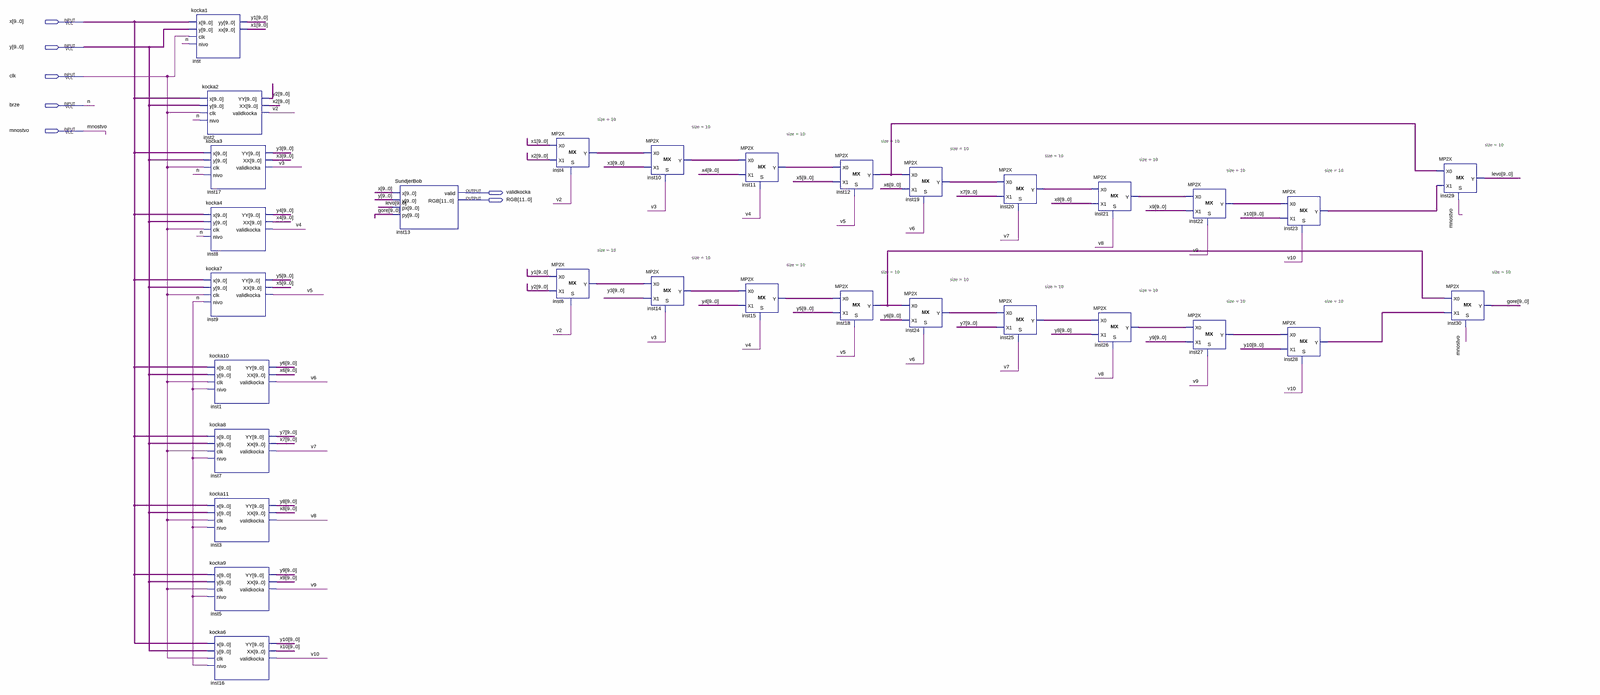
[diagram p0: schematic sheet, whole]
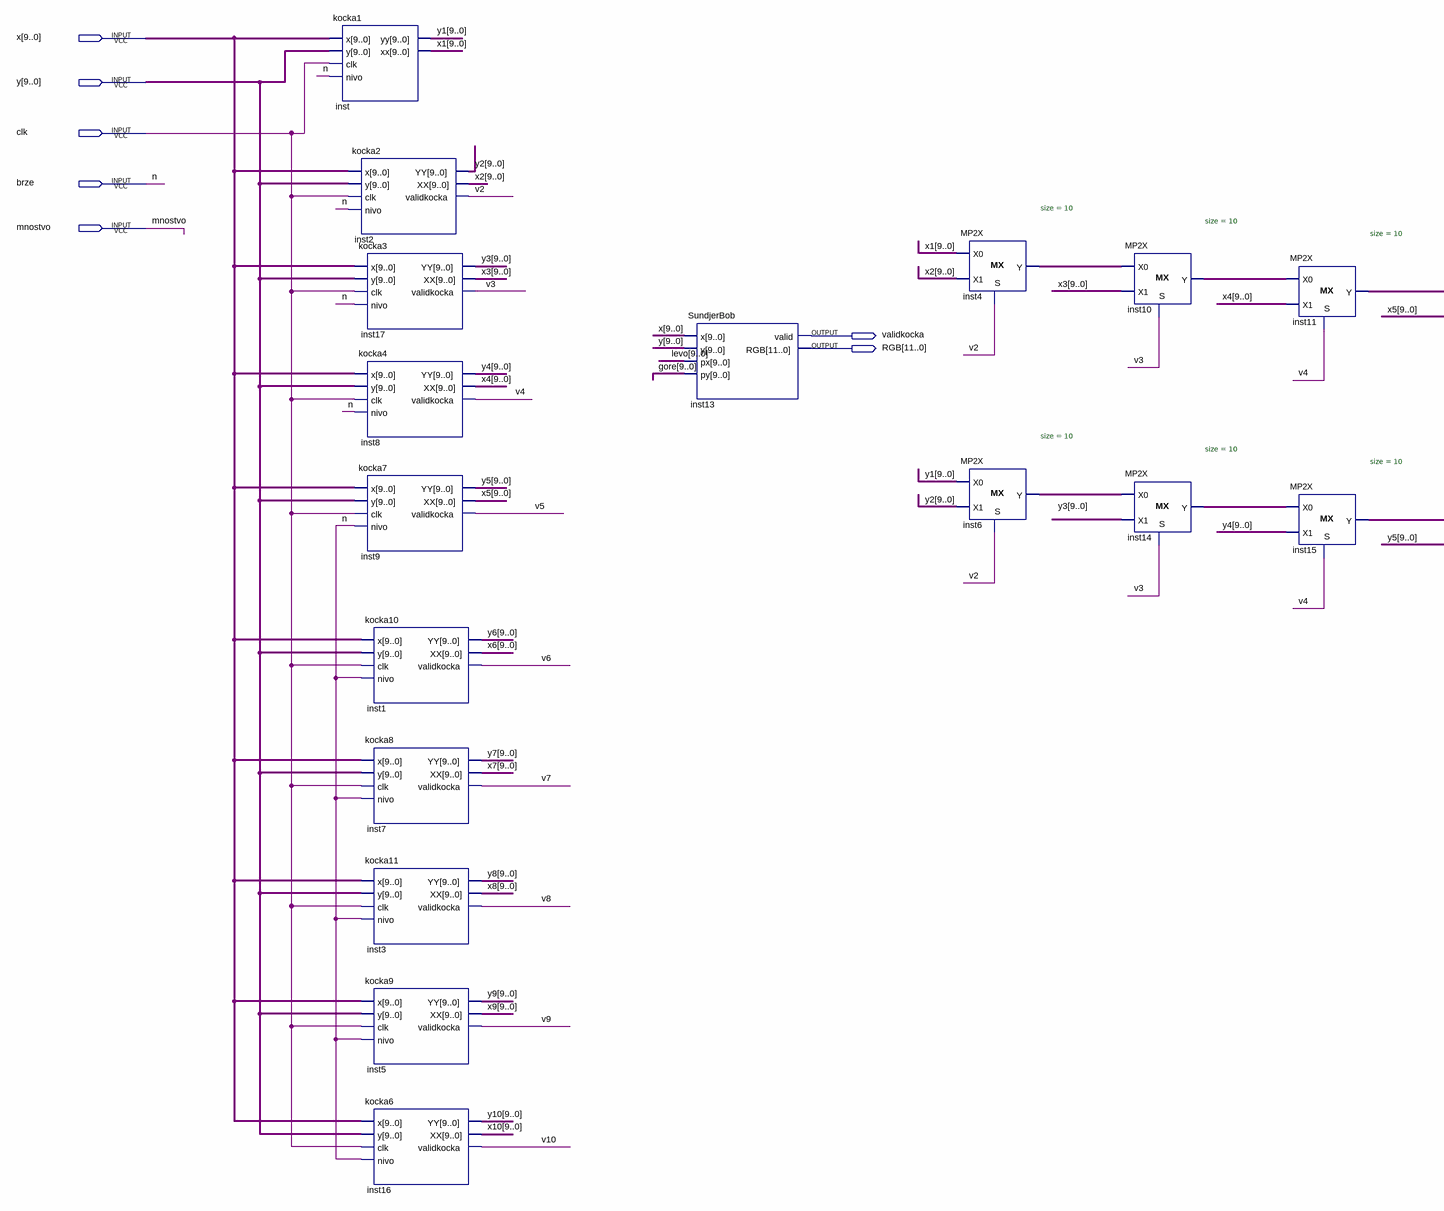
[diagram p1: schematic sheet, left part]
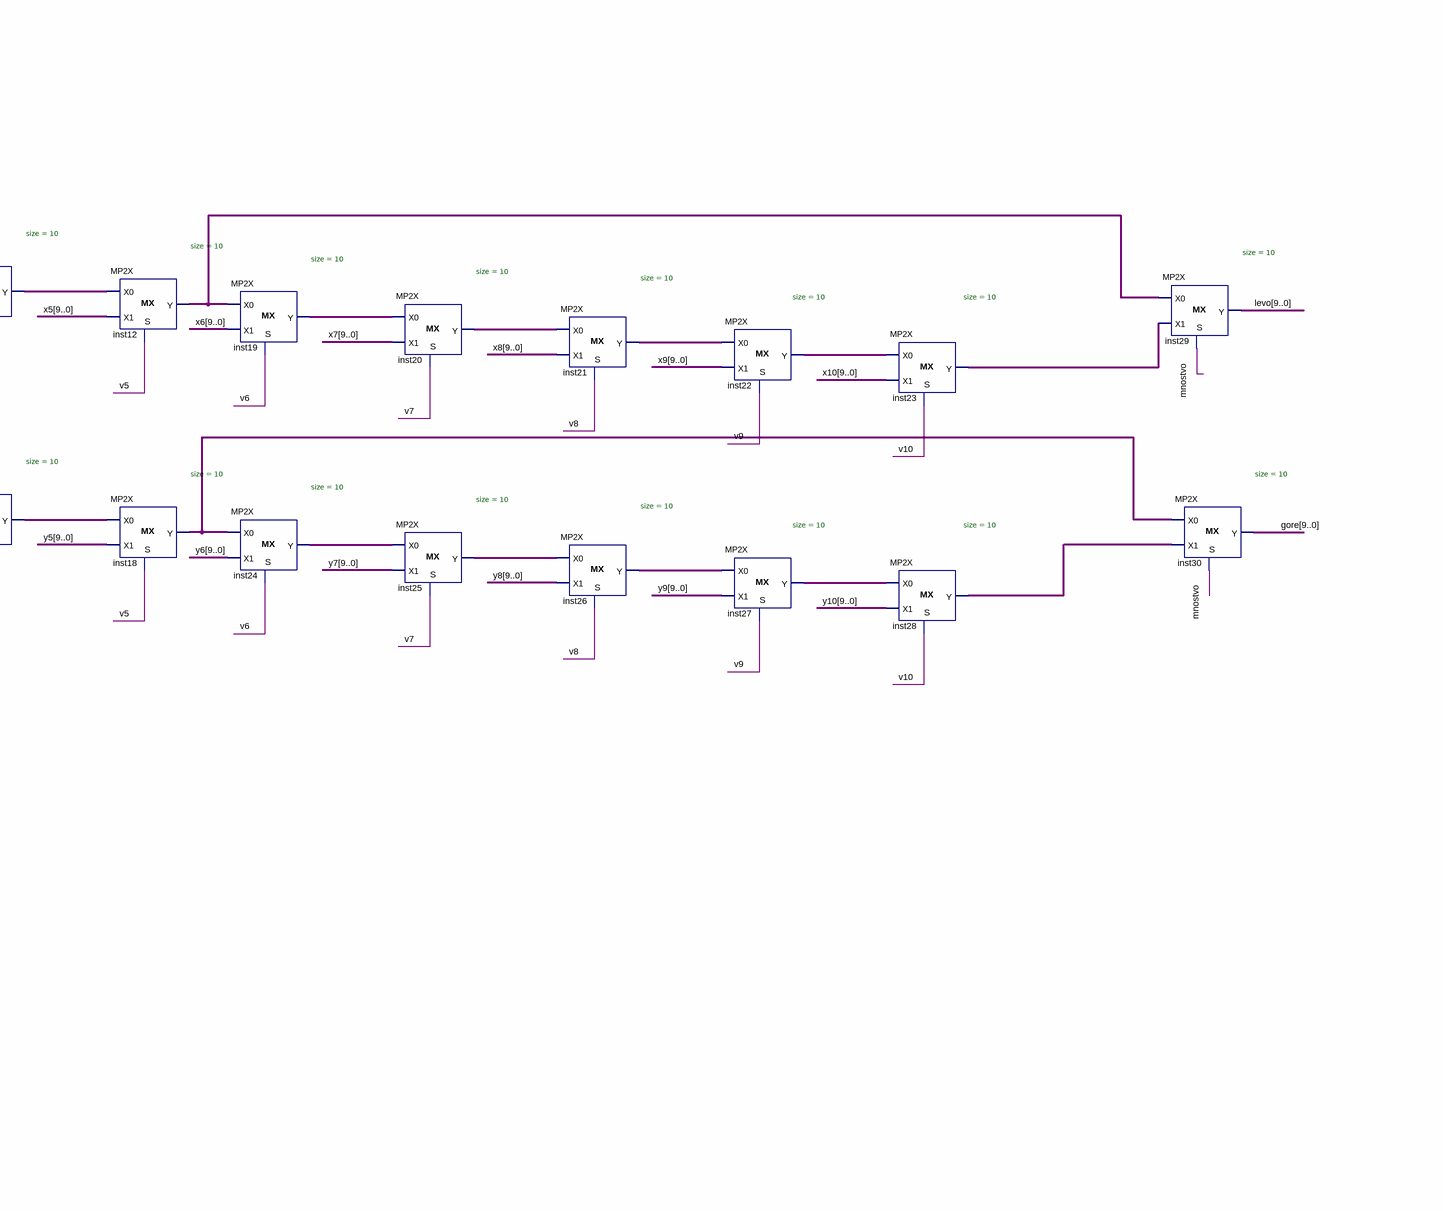
[diagram p2: schematic sheet, right part]
// Quartus schematic prepreke.bdf as structural Verilog: 31 symbols, 7 pins
module prepreke (
  input  [9:0] x,
  input  [9:0] y,
  input  clk,
  input  brze,
  input  mnostvo,
  output validkocka,
  output [11:0] RGB
);

  wire v2, v3, v4, v5, v6, v7, v8, v9, v10;
  wire [9:0] gore, inst4_y, inst6_y, inst10_y, inst11_y, inst12_y, inst14_y, inst15_y, inst18_y, inst19_y,
       inst20_y, inst21_y, inst22_y, inst23_y, inst24_y, inst25_y, inst26_y, inst27_y, inst28_y, levo, x1,
       x2, x3, x4, x5, x6, x7, x8, x9, x10, y1, y2, y3, y4, y5, y6, y7, y8, y9, y10;

  kocka1 inst (.x(x), .y(y), .clk(clk), .nivo(brze), .yy(y1), .xx(x1));
  kocka2 inst2 (.x(x), .y(y), .clk(clk), .nivo(brze), .YY(y2), .XX(x2), .validkocka(v2));
  kocka3 inst17 (.x(x), .y(y), .clk(clk), .nivo(brze), .YY(y3), .XX(x3), .validkocka(v3));
  kocka4 inst8 (.x(x), .y(y), .clk(clk), .nivo(brze), .YY(y4), .XX(x4), .validkocka(v4));
  kocka7 inst9 (.x(x), .y(y), .clk(clk), .nivo(brze), .YY(y5), .XX(x5), .validkocka(v5));
  kocka10 inst1 (.x(x), .y(y), .clk(clk), .nivo(brze), .YY(y6), .XX(x6), .validkocka(v6));
  kocka8 inst7 (.x(x), .y(y), .clk(clk), .nivo(brze), .YY(y7), .XX(x7), .validkocka(v7));
  kocka11 inst3 (.x(x), .y(y), .clk(clk), .nivo(brze), .YY(y8), .XX(x8), .validkocka(v8));
  kocka9 inst5 (.x(x), .y(y), .clk(clk), .nivo(brze), .YY(y9), .XX(x9), .validkocka(v9));
  kocka6 inst16 (.x(x), .y(y), .clk(clk), .nivo(brze), .YY(y10), .XX(x10), .validkocka(v10));
  SundjerBob inst13 (.x(x), .y(y), .px(levo), .py(gore), .valid(validkocka), .RGB(RGB));
  MP2X #(.size(10)) inst4 (.S(v2), .X0(x1), .X1(x2), .Y(inst4_y));
  MP2X #(.size(10)) inst6 (.S(v2), .X0(y1), .X1(y2), .Y(inst6_y));
  MP2X #(.size(10)) inst10 (.S(v3), .X0(inst4_y), .X1(x3), .Y(inst10_y));
  MP2X #(.size(10)) inst14 (.S(v3), .X0(inst6_y), .X1(y3), .Y(inst14_y));
  MP2X #(.size(10)) inst11 (.S(v4), .X0(inst10_y), .X1(x4), .Y(inst11_y));
  MP2X #(.size(10)) inst15 (.S(v4), .X0(inst14_y), .X1(y4), .Y(inst15_y));
  MP2X #(.size(10)) inst12 (.S(v5), .X0(inst11_y), .X1(x5), .Y(inst12_y));
  MP2X #(.size(10)) inst18 (.S(v5), .X0(inst15_y), .X1(y5), .Y(inst18_y));
  MP2X #(.size(10)) inst19 (.S(v6), .X0(inst12_y), .X1(x6), .Y(inst19_y));
  MP2X #(.size(10)) inst24 (.S(v6), .X0(inst18_y), .X1(y6), .Y(inst24_y));
  MP2X #(.size(10)) inst20 (.S(v7), .X0(inst19_y), .X1(x7), .Y(inst20_y));
  MP2X #(.size(10)) inst25 (.S(v7), .X0(inst24_y), .X1(y7), .Y(inst25_y));
  MP2X #(.size(10)) inst21 (.S(v8), .X0(inst20_y), .X1(x8), .Y(inst21_y));
  MP2X #(.size(10)) inst26 (.S(v8), .X0(inst25_y), .X1(y8), .Y(inst26_y));
  MP2X #(.size(10)) inst22 (.S(v9), .X0(inst21_y), .X1(x9), .Y(inst22_y));
  MP2X #(.size(10)) inst27 (.S(v9), .X0(inst26_y), .X1(y9), .Y(inst27_y));
  MP2X #(.size(10)) inst23 (.S(v10), .X0(inst22_y), .X1(x10), .Y(inst23_y));
  MP2X #(.size(10)) inst28 (.S(v10), .X0(inst27_y), .X1(y10), .Y(inst28_y));
  MP2X #(.size(10)) inst29 (.S(mnostvo), .X0(inst12_y), .X1(inst23_y), .Y(levo));
  MP2X #(.size(10)) inst30 (.S(mnostvo), .X0(inst18_y), .X1(inst28_y), .Y(gore));

  // Other names for the same wires on the sheet: n = brze
endmodule
